# EAGLE design mySensorsRS485GW_back (EAGLE 8.1.1)
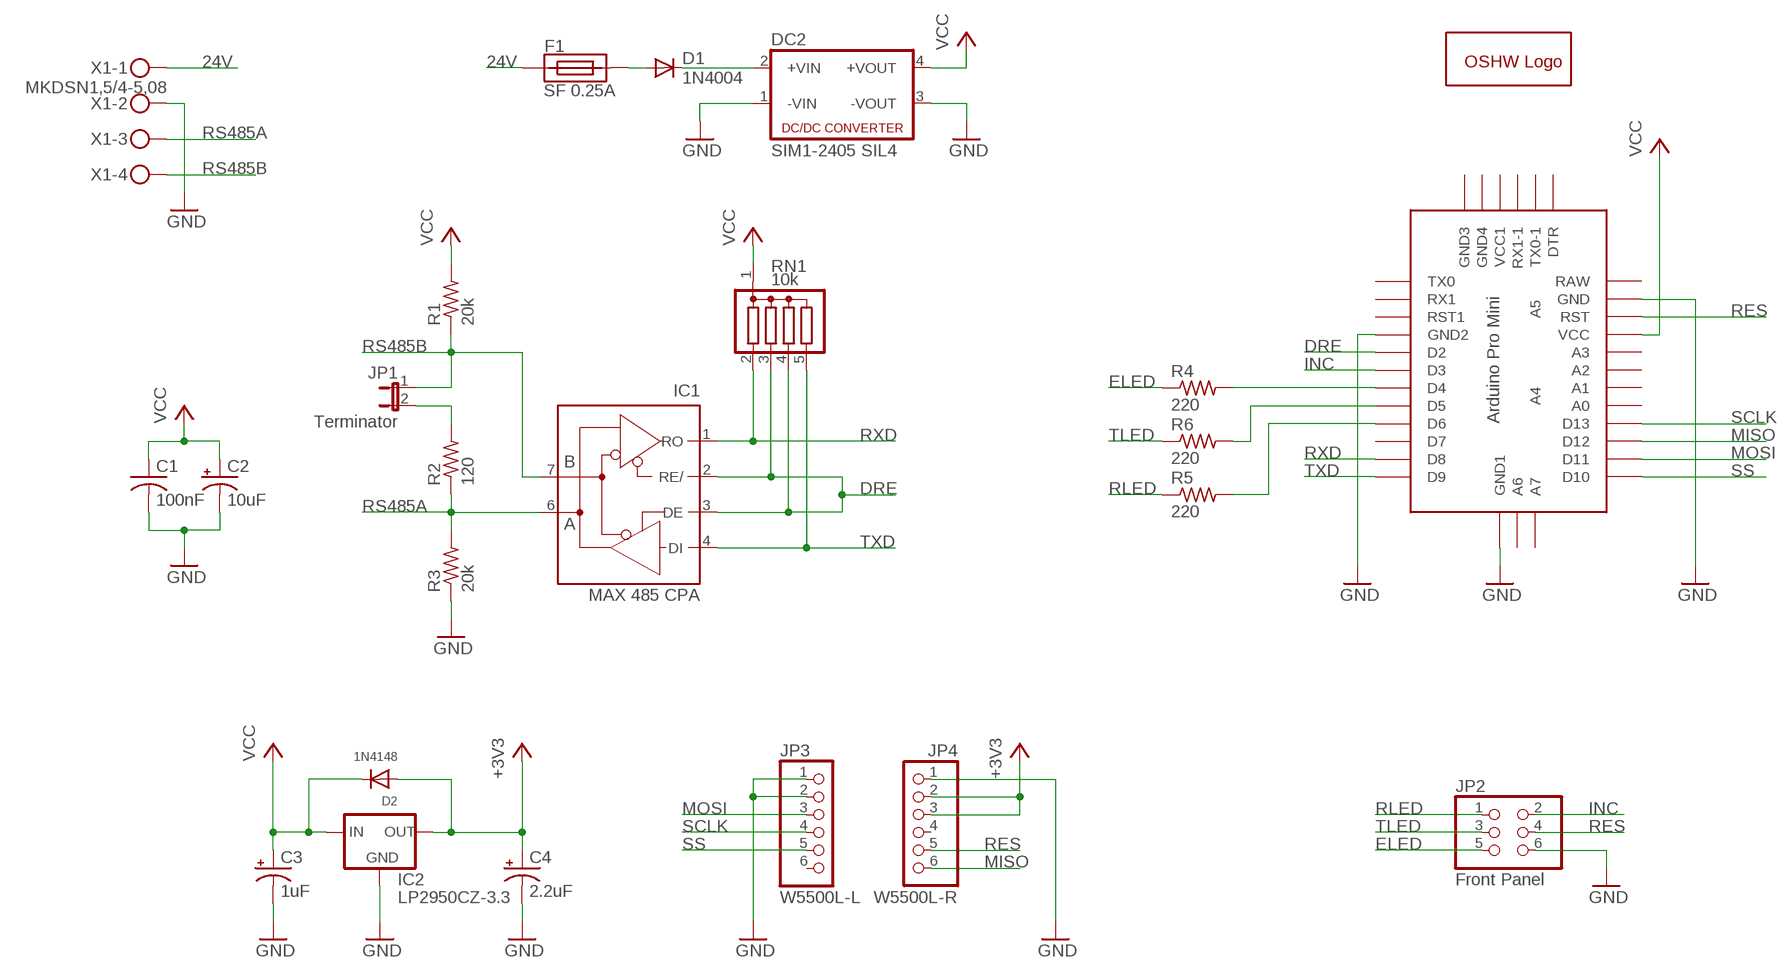
[diagram p0: schematic, sheet 1]

## Parts
C1  100nF  C-US025-025X050  [C025-025X050]
C2  10uF  CPOL-USTT2D5  [TT2D5]
C3  1uF  CPOL-USTT2D5  [TT2D5]
C4  2.2uF  CPOL-USTT2D5  [TT2D5]
D1  1N4004  [DO41-10]
D2  1N4148  DIODEDO-1N4148  [DO-1N4148]
DC2  SIM1-2405 SIL4  NME  [NME]
F1  SF 0.25A  SMF_OMNIBLOK_154.062  [NANO2_SMF_FUSEBLOCK]
GOLD_ORB_SM1  OSHWLOGOLOGO5MM  [OSHW_5MM]
IC1  MAX 485 CPA  MAX481CPA  [DIL08]
IC2  LP2950CZ-3.3  [TO92]
JP1  Terminator  JP1E  [JP1]
JP2  Front Panel  PINHD-2X3  [2X03]
JP3  W5500L-L  PINHD-1X6  [1X06]
JP4  W5500L-R  PINHD-1X6  [1X06]
R1  20k  R-US_0207/2V  [0207/2V]
R2  120  R-US_0207/2V  [0207/2V]
R3  20k  R-US_0207/2V  [0207/2V]
R4  220  R-US_0207/7  [0207/7]
R5  220  R-US_0207/7  [0207/7]
R6  220  R-US_0207/7  [0207/7]
RN1  10k  G04R  [SIL5]
U$1  ABK-PRO-MINI  [ABK-PRO-MINI]
X1  MKDSN1,5/4-5,08  [MKDSN1,5/4-5,08]

## Nets
24V: F1.1 X1.1
+3V3: C4.+ D2.A IC2.1(OUT) JP4.2 JP4.3
DRE: IC1.2(RE/) IC1.3(DE) RN1.3 RN1.4 U$1.D2
ELED: JP2.5 R4.1
GND: C1.2 C2.- C3.- C4.- DC2.1(-VIN) DC2.3(-VOUT) IC2.2(GND) JP2.6 JP3.1 JP3.2 JP4.1 R3.1 U$1.GND U$1.GND1(GND2) U$1.GND4(GND1) X1.2
INC: JP2.2 U$1.D3
MISO: JP4.6 U$1.D12
MOSI: JP3.3 U$1.D11
N$1: R4.2 U$1.D4
N$2: D1.A F1.2
N$3: D1.C DC2.2(+VIN)
N$4: R6.2 U$1.D5
N$5: R5.2 U$1.D6
N$6: JP1.2 R2.2
RES: JP2.4 JP4.5 U$1.RST
RLED: JP2.1 R5.1
RS485A: IC1.6(A) R2.1 R3.2 X1.3
RS485B: IC1.7(B) JP1.1 R1.1 X1.4
RXD: IC1.1(RO) RN1.2 U$1.D8
SCLK: JP3.4 U$1.D13
SS: JP3.5 U$1.D10
TLED: JP2.3 R6.1
TXD: IC1.4(DI) RN1.5 U$1.D9
VCC: C1.1 C2.+ C3.+ D2.C DC2.4(+VOUT) IC2.3(IN) R1.2 RN1.1 U$1.VCC
Unconnected: JP3.6 JP4.4 U$1.A0 U$1.A1 U$1.A2 U$1.A3 U$1.A4 U$1.A5 U$1.A6 U$1.A7 U$1.D7 U$1.DTR U$1.GND2(GND3) U$1.GND3(GND4) U$1.RAW U$1.RST1 U$1.RX1 U$1.RX1-1 U$1.TX0 U$1.TX0-1 U$1.VCC1

## Power pins joined to a net without a drawn wire
GND: IC1.5(GND)
VCC: IC1.8(VCC)

## Library data of the parts
C1 = rcl:C-US: CAPACITOR, American symbol
C2-C4 = resistor:CPOL-US: POLARIZED CAPACITOR, American symbol
D1 = adafruit:1N4004: DIODE General purpose 1N400x type rectifier (With bigger pads) http://www.ladyada.net/library/pcb/eaglelibrary.html
D2 = adafruit:DIODE: Diode SMADIODE - SMA Surface Mount Package 20V 1A Schottky Diode Digikey: 641-1014-6-ND DO-1N4148 - Through Hole Small Current Diode SOD-123 20V 1 A (.5mV Vf) Schottky Diode - Digikey: MBRX120TPMSCT-ND SOD-323 10V 570mA (.38mV Vf, 3ns) Schottky Diode - Digikey: ZLLS410CT-ND SOD-523 30V 30mA Schottky Diode (RB751S-40TE61) - Digikey: RB751S-40TE61CT-ND SOT23-R/W - SOT23 Package (R = Solder Paste/Reflow Ovens, W = Hand-Soldering) BAT54Film 40V 300mA - Digikey: 497-7162-1-ND
DC2 = dc-dc-converter:NME: DC-DC CONVERTER; MF: C & D TECHNOLOGIES, INC; MPN: NME1205D; OC_FARNELL: 1021466; OC_NEWARK: 98B8198
F1 = _hhn_littlefuse_Nano2SMF_2:SMF_OMNIBLOK_154: Littlefuse SMF OMNI-BLOK (R) Fuse Holder with Installed Fuse (NANO2 SMF): Series 154 Source: http://www.littlefuse.com Technologies (ROHS-compliant): Very Fast-Acting Fuse Installed: 154.x = rating x mA 154 0[..]y = rating y A Slow-Acting Fuse Installed (Slo-Blo (R)) 154.xT = rating x mA 154 0[..]yT = rating y A Author: Dipl.-Ing. FH Rainer Bayer HHN Hochschule Heilbronn, rainer.bayer@hs-heilbronn.de Ingenieurbüro ing-rb, mail@ing-rb.de
GOLD_ORB_SM1 = oshw:OSHWLOGO: The OSHW logo for PCB layout
IC1 = maxim:MAX481CPA: RS485 TRANSEIVER; MPN: MAX481CPA+; OC_FARNELL: unknown; OC_NEWARK: 99K3445
IC2 = v-reg:LP2950?*: Source: http://cache.national.com/ds/LP/LP2950.pdf
JP1 = jumper:JP1E: JUMPER
JP2 = pinhead:PINHD-2X3: PIN HEADER
JP3 JP4 = adafruit:PINHD-1X6: PIN HEADER
R1-R6 = resistor:R-US_: RESISTOR, American symbol
RN1 = resistor-sil:G04R: SIL RESISTOR; OC_FARNELL: unknown; OC_NEWARK: unknown
U$1 = Arduino-clone:ABK-PRO-MINI: ABK Pro-Mini Arduino Clone
X1 = con-phoenix-508:MKDSN1,5/4-5,08: MKDSN 1,5/ 4-5,08 Printklemme Nennstrom: 13,5 A Nennspannung: 250 V Rastermaß: 5,08 mm Polzahl: 4 Anschlussart: Schraubanschluss Montage: Löten Anschlussrichtung Leiter/Platine: 0 ° Artikelnummer: 1729144 Source: http://eshop.phoenixcontact.com .. 1729144.pdf

## Net classes
0 default: width 0.305 mm, drill 0.508 mm, clearance 0.254 mm

## Board
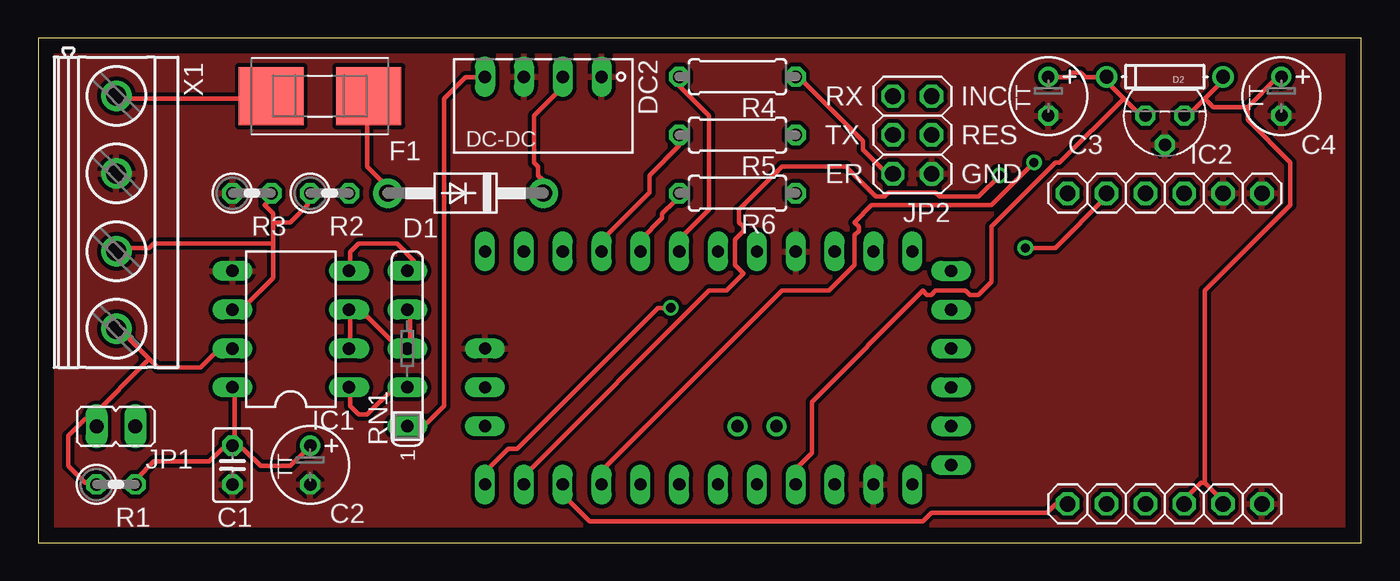
[diagram p1: board, top side]
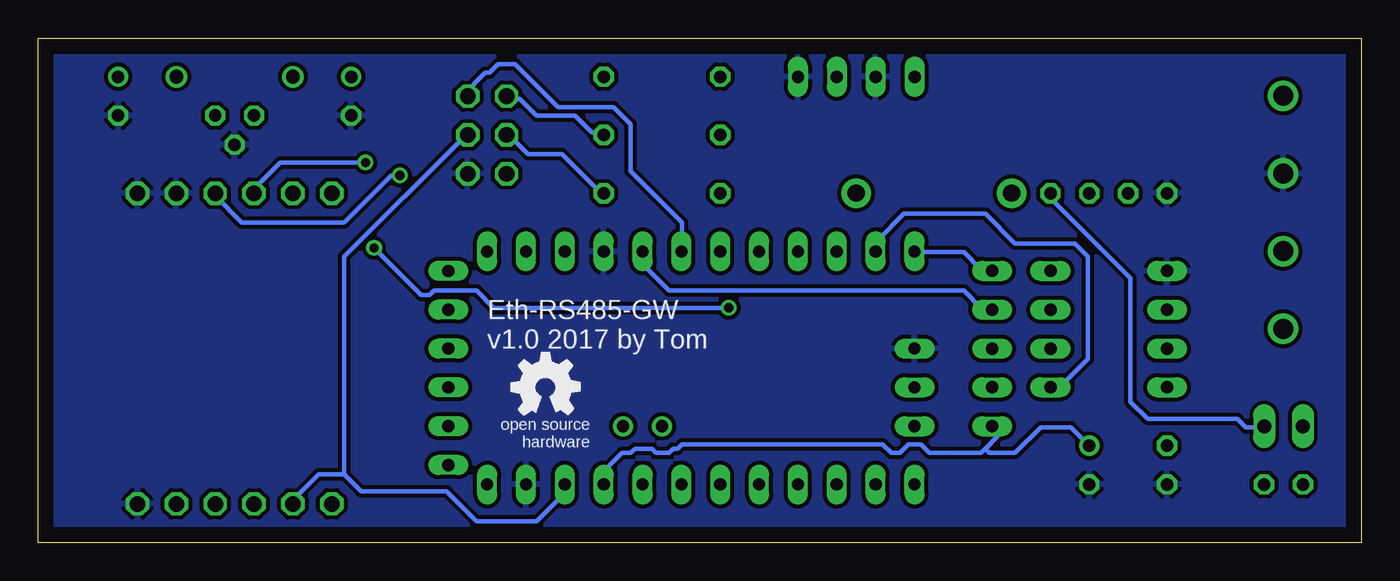
[diagram p2: board, bottom side, seen from below]

Size 86.5 x 33 mm. Coordinates in mm from the lower left corner, seen from the top.
Outline: 0,0 86.5,0 86.5,33 0,33 0,0
Copper layers (1*16): Top 0.035mm / dielectric 1.5mm / Bottom 0.035mm
Design rules "default": minimum track width 10mil, minimum drill 24mil, track to track 8mil, track to pad 8mil, pad to pad 8mil, via to via 8mil, smd to smd 8mil, copper to edge 40mil, drill to drill 8mil, minimum pad ring 10mil, minimum via ring 8mil, stop-mask expansion 4mil, vias tented up to drill 0mil, thermal gap 10mil

### Footprints (pad centres in the part's own frame; a part is rotated, then mirrored left to right if it is on the bottom)
C025-025X050 = drill 0.813 octagon: 1 -1.27,0; 2 1.27,0
TT2D5 = drill 0.813: + -1.27,0 | drill 0.813 octagon: - 1.27,0
DO41-10 = drill 1.118 pad 1.93: A 5.08,0; C -5.08,0
DO-1N4148 = drill 0.9: A -3.81,0; C 3.81,0
NME = drill 0.813 long: 1 0,3.81; 2 0,1.27; 3 0,-1.27; 4 0,-3.81
NANO2_SMF_FUSEBLOCK = smd 4.24 x 3.81: 1 -3.19,0; 2 3.19,0
DIL08 = drill 0.813 long: 1 -3.81,-3.81; 2 -1.27,-3.81; 3 1.27,-3.81; 4 3.81,-3.81; 5 3.81,3.81; 6 1.27,3.81; 7 -1.27,3.81; 8 -3.81,3.81
TO92 = drill 0.813 octagon: 1 -1.27,0; 2 0,1.905; 3 1.27,0
JP1 = drill 0.914 long: 1 0,-1.27; 2 0,1.27
2X03 = drill 1.016 octagon: 1 -2.54,-1.27; 2 -2.54,1.27; 3 0,-1.27; 4 0,1.27; 5 2.54,-1.27; 6 2.54,1.27
1X06 = drill 1.016 octagon: 1 -6.35,0; 2 -3.81,0; 3 -1.27,0; 4 1.27,0; 5 3.81,0; 6 6.35,0
0207/2V = drill 0.813 octagon: 1 -1.27,0; 2 1.27,0
0207/7 = drill 0.813 octagon: 1 -3.81,0; 2 3.81,0
SIL5 = drill 0.813 long: 1 -5.08,0; 2 -2.54,0; 3 0,0; 4 2.54,0; 5 5.08,0
ABK-PRO-MINI = drill 0.8 long: A0 10.16,-3.81; A1 10.16,-6.35; A2 10.16,-8.89; A3 10.16,-11.43; A6 3.81,-21.59; A7 6.35,-21.59; D2 -5.08,-3.81; D3 -5.08,-6.35; D4 -5.08,-8.89; D5 -5.08,-11.43; D6 -5.08,-13.97; D7 -5.08,-16.51; D8 -5.08,-19.05; D9 -5.08,-21.59; D10 10.16,-21.59; D11 10.16,-19.05; D12 10.16,-16.51; D13 10.16,-13.97; DTR 8.89,8.89; GND 10.16,3.81; GND1 -5.08,-1.27; GND2 -3.81,8.89; GND3 -1.27,8.89; GND4 1.27,-21.59; RAW 10.16,6.35; RST 10.16,1.27; RST1 -5.08,1.27; RX1 -5.08,3.81; RX1-1 3.81,8.89; TX0 -5.08,6.35; TX0-1 6.35,8.89; VCC 10.16,-1.27; VCC1 1.27,8.89 | drill 0.8: A4 6.35,-5.08; A5 6.35,-2.54
MKDSN1,5/4-5,08 = drill 1.3 pad 2: 1 -7.641,0.025; 2 -2.561,0.025; 3 2.519,0.025; 4 7.599,0.025

### Placement (x,y rotation side)
C1  12.7,5.08 270 top
C2  17.78,5.08 270 top
C3  66.04,29.21 270 top
C4  81.28,29.21 270 top
D1  27.94,22.86 180 top
D2  73.66,30.48 180 top
DC2  33.02,30.48 270 top
F1  18.41,29.21 0 top
GOLD_ORB_SM1  53.34,10.16 0 bottom
IC1  16.51,13.97 90 top
IC2  73.66,27.94 180 top
JP1  5.08,7.62 270 top
JP2  57.15,26.67 270 top
JP3  73.66,22.86 180 top
JP4  73.66,2.54 180 top
R1  5.08,3.81 0 top
R2  19.05,22.86 0 top
R3  13.97,22.86 0 top
R4  45.72,30.48 180 top
R5  45.72,26.67 180 top
R6  45.72,22.86 180 top
RN1  24.13,12.7 90 top
U$1  50.8,13.97 270 top
X1  5.08,21.59 270 top

### Tracks (layer width: path | path; a pad name or v marks a point on that pad's centre or on a via)
24V
  Top 0.305: X1.1 5.31,29.06 15.09,29.06 F1.1
+3V3
  Top 0.305: 76.28,3.91 76,3.91 75.16,3.07 75.16,2.79 JP4.3 | 76.28,3.91 77.11,3.07 77.39,3.07 77.67,2.79 JP4.2 | 76.28,29.06 77.67,30.45 D2.A | 76.28,29.06 75.16,27.94 IC2.1 | 79.07,28.5 81.03,30.45 C4.+ | 79.07,28.5 76.83,28.5 76.28,29.06 | 76.28,3.91 76.28,16.48 81.86,22.07 81.86,24.87 79.07,27.66 79.07,28.5
DRE
  Top 0.305: 20.4,14.81 20.4,15.09 IC1.3 20.4,14.81 | 20.4,14.81 20.4,12.85 IC1.2 | RN1.4 24.31,15.09 24.31,12.85 RN1.3 24.03,12.85 23.47,12.85 21.51,14.81 20.4,14.81
  Bottom 0.305: U$1.D2 46.94,19 46.94,18.16 45.26,16.48 25.98,16.48 24.87,15.37 24.31,15.37 RN1.4
ELED
  Top 0.305: R4.1 49.73,30.45 53.92,26.26 53.92,25.7 55.32,24.31 55.88,24.31 JP2.5
GND
  pour Bottom: -1.27,34.29 87.63,34.29 87.63,-1.27 -1.27,-1.27
  pour Top: 87.63,34.29 87.63,-1.27 -1.27,-1.27 -1.27,34.29
INC
  Bottom 0.305: U$1.D3 44.42,19.28 44.42,20.95 47.78,24.31 47.78,27.38 48.9,28.5 52.53,28.5 55.32,31.29 56.44,31.29 57,30.73 57.28,30.73 58.67,29.34 JP2.2
MISO
  Top 0.305: U$1.D12 34.37,3.63 34.37,3.07 36.04,1.4 57.84,1.4 58.4,1.96 65.94,1.96 66.5,2.52 67.06,2.52 JP4.6
MOSI  (via drill 0.61)
  Top 0.305: v62.87,24.03 61.47,22.63 58.95,22.63 58.67,22.91 55.6,22.91 55.32,22.63 54.76,22.63 52.81,24.59 48.62,24.59 45.82,21.79 45.82,20.95 46.1,20.68 46.1,20.4 45.54,19.84 45.54,18.16 46.1,17.6 44.98,16.48 43.87,16.48 31.85,4.47 31.85,3.91 U$1.D11
  Bottom 0.305: v62.87,24.03 63.42,24.03 66.5,20.95 73.2,20.95 74.88,22.63 JP3.3
N$1
  Top 0.305: U$1.D4 41.91,19.84 43.87,21.79 43.87,27.94 41.91,29.9 R4.2
N$2
  Top 0.305: D1.A 22.63,22.91 22.63,23.47 21.51,24.59 21.51,29.06 F1.2
N$3
  Top 0.305: DC2.2 34.09,30.45 34.09,29.62 32.41,27.94 32.41,24.87 32.69,24.59 32.69,24.03 32.97,23.75 32.97,22.91 D1.C
N$4
  Top 0.305: U$1.D5 39.4,19.28 39.4,19.84 40.79,21.23 40.79,21.51 41.63,22.35 41.63,22.63 41.91,22.91 R6.2
N$5
  Top 0.305: R5.2 41.91,25.98 39.95,24.03 39.95,22.91 36.88,19.84 36.88,19.28 U$1.D6
N$6
  Bottom 0.305: R2.2 20.12,22.63 20.12,22.35 15.09,17.32 15.09,9.22 13.97,8.1 8.1,8.1 7.54,7.54 6.43,7.54 JP1.2
RES
  Bottom 0.305: 66.5,4.47 65.38,3.35 59.79,3.35 57.84,1.4 53.92,1.4 52.25,3.07 52.25,3.63 U$1.RST | 66.5,4.47 68.17,4.47 69.85,2.79 JP4.5 | 66.5,4.47 66.5,18.72 58.67,26.54 JP2.4
RLED
  Bottom 0.305: R5.1 49.73,26.82 50.29,26.82 51.41,27.94 53.92,27.94 55.04,29.06 55.88,29.06 JP2.1
RS485A
  Top 0.305: 15.37,20.95 15.37,21.51 14.81,22.07 15.37,22.63 R3.2 | 15.37,20.95 15.37,19.56 | 15.37,19.56 15.37,17.32 13.41,15.37 12.85,15.37 IC1.6 | 15.37,20.95 16.48,20.95 17.6,22.07 17.6,22.63 R2.1 | 15.37,19.56 7.54,19.56 7.26,19.28 5.31,19.28 X1.3
RS485B
  Top 0.305: 3.35,8.1 3.07,8.1 1.96,6.99 1.96,5.03 3.07,3.91 3.63,3.91 R1.1 | 3.35,8.1 3.63,7.82 JP1.1 3.35,8.1 | 7.26,12.01 5.31,13.97 X1.4 | 7.26,12.01 7.82,11.46 10.62,11.46 11.73,12.57 12.57,12.57 IC1.7 | 7.26,12.01 3.35,8.1
RXD
  Top 0.305: RN1.2 24.03,10.06 23.19,10.06 21.51,8.38 20.95,8.38 20.4,8.94 20.4,10.06 IC1.1
  Bottom 0.305: U$1.D8 31.57,19.28 31.57,19.84 29.9,21.51 24.59,21.51 22.63,19.56 18.72,19.56 17.88,18.72 17.88,12.01 19.56,10.34 20.12,10.34 IC1.1
SCLK  (via drill 0.61)
  Top 0.305: v65.1,24.87 62.31,22.07 54.48,22.07 53.37,20.95 53.65,20.68 53.65,20.4 53.37,20.12 53.37,18.16 51.69,16.48 48.62,16.48 36.88,4.75 36.88,3.91 U$1.D13
  Bottom 0.305: v65.1,24.87 70.69,24.87 72.64,22.91 JP3.4
SS  (via drill 0.61)
  Top 0.305: v41.35,15.37 40.51,15.37 31.29,6.15 30.73,6.15 29.34,4.75 29.34,3.91 U$1.D10 | v64.54,19.28 66.5,19.28 69.85,22.63 JP3.5
  Bottom 0.305: v41.35,15.37 56.72,15.37 57.84,16.48 60.63,16.48 60.91,16.2 61.47,16.2 v64.54,19.28
TLED
  Bottom 0.305: R6.1 49.73,22.91 52.25,25.43 54.48,25.43 55.88,26.82 JP2.3
TXD
  Top 0.305: IC1.4 20.4,17.88 20.4,19 20.95,19.56 23.47,19.56 24.59,18.44 24.59,18.16 24.31,17.88 RN1.5
  Bottom 0.305: U$1.D9 29.06,19 25.98,19 24.87,17.88 24.31,17.88 RN1.5
VCC
  Top 0.305: R1.2 6.43,3.91 6.43,4.19 7.54,5.31 11.18,5.31 12.01,6.15 12.57,6.15 C1.1 | C2.+ 17.6,6.15 16.48,5.03 14.53,5.03 13.41,6.15 12.85,6.15 C1.1 | IC1.8 12.85,10.06 12.85,6.43 C1.1 | 69.57,30.45 69.85,30.45 D2.C 69.57,30.45 | 69.57,30.45 68.45,30.45 68.17,30.73 67.61,30.73 67.33,30.45 66.22,30.45 C3.+ | IC2.3 72.08,27.94 70.97,29.06 | 69.57,30.45 70.97,29.06 | DC2.4 29.06,30.45 27.94,30.45 26.54,29.06 26.54,8.94 25.43,7.82 24.31,7.82 RN1.1 | 70.97,29.06 66.78,24.87 66.5,24.87 62.31,20.68 62.31,17.04 61.47,16.2 60.91,16.2 60.63,16.48 58.67,16.48 58.4,16.2 58.12,16.2 57.84,16.48 50.57,9.22 50.57,5.87 49.73,5.03 49.73,3.91 U$1.VCC
  Bottom 0.305: 24.59,6.15 23.75,6.99 23.75,7.26 24.03,7.54 RN1.1 | 24.59,6.15 24.87,5.87 28.22,5.87 28.78,6.43 29.62,6.43 30.18,5.87 30.73,5.87 31.29,6.43 44.42,6.43 44.7,6.15 44.98,6.15 45.26,5.87 46.1,5.87 46.38,6.15 47.5,6.15 47.78,5.87 48.34,5.87 49.45,4.75 49.45,3.91 U$1.VCC | 24.59,6.15 24.31,5.87 22.63,5.87 20.95,7.54 19,7.54 17.88,6.43 C2.+

### Text on the board
tPlace: RX | INC | TX | RES | ER | GND
bPlace: Eth-RS485-GW / v1.0 2017 by Tom